# Altium schematic sheet bumblebee.SchDoc: bumblebee macropad
size A3; DrawnBy: Samir Ahmed; DocumentNumber: 1; Revision: 0.2; SheetNumber: 1; SheetTotal: 1; ENG_APP_DATE: --/--/--; DSN_APP_DATE: --/--/--; CHK_APP_DATE: --/--/--
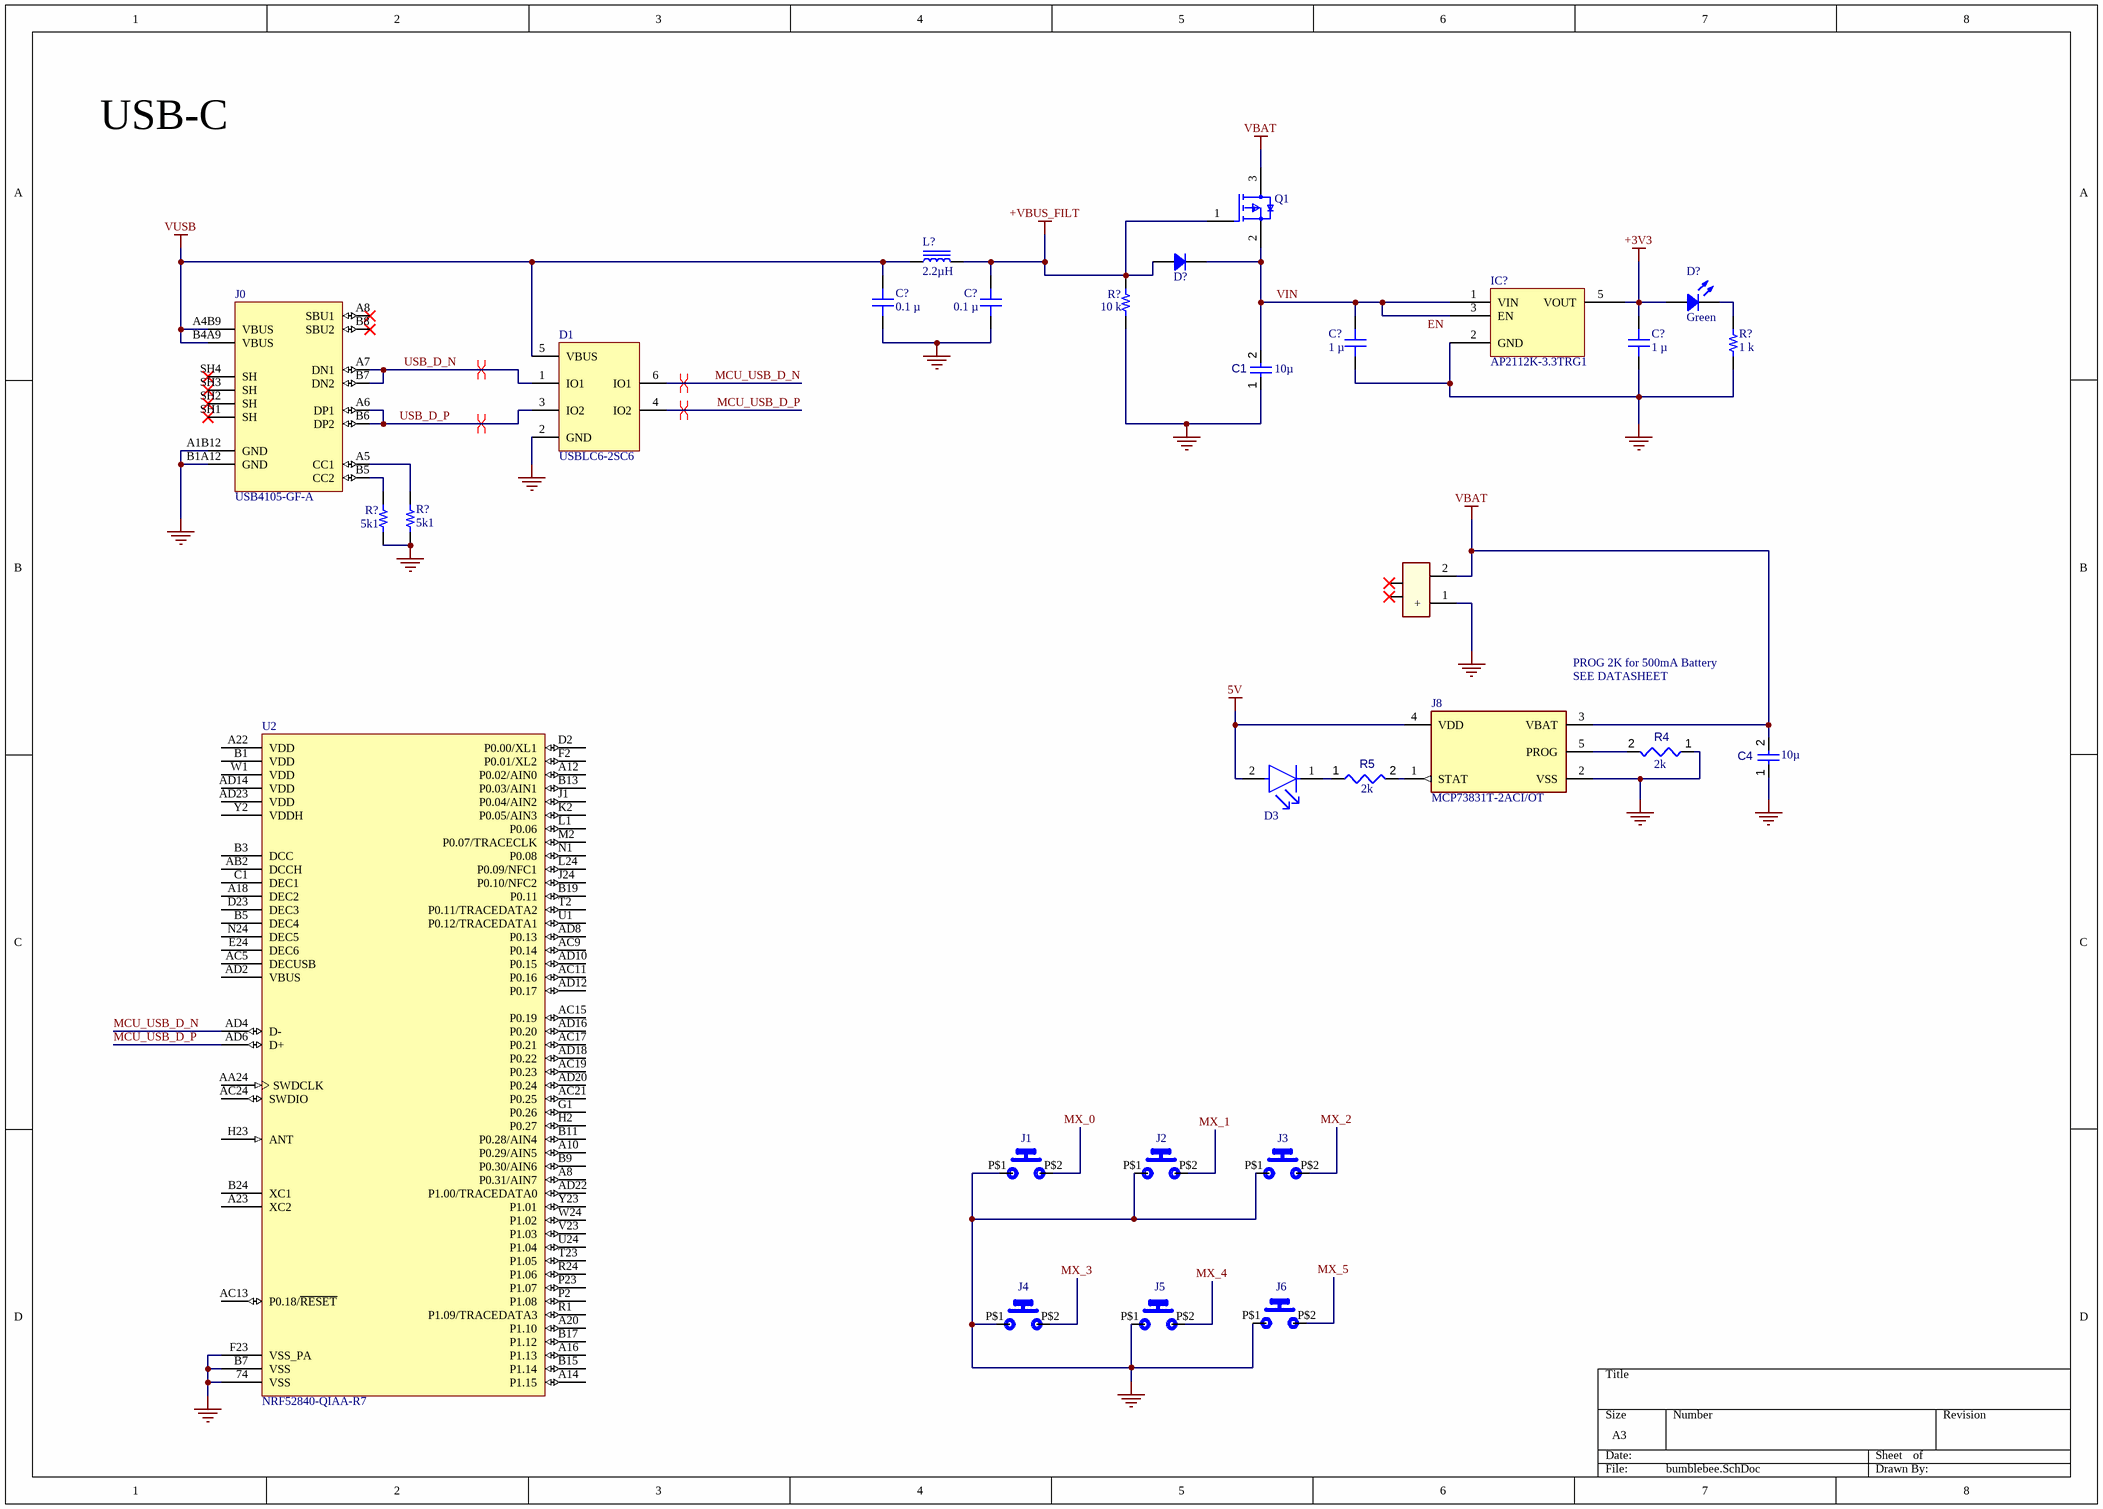
[diagram p0: bumblebee.SchDoc]

## Parts
(Parts that share a designator on the sheet are numbered #1, #2 ... from top to bottom, then left to right.)
C1  value 10µ  [CAPC0603(1608)100_L]  (hidden comment: Capacitor 10µF +/-20% 10V 0603)
C4  value 10µ  [CAPC0603(1608)100_L]  (hidden comment: Capacitor 10µF +/-20% 10V 0603)
C?#1  0.1 µ  [CAP 0402_1005]
C?#2  0.1 µ  [CAP 0402_1005]
C?#3  1 µ  [CAP 0402_1005]
C?#4  1 µ  [CAP 0402_1005]
D1  USBLC6-2SC6  [STM-SOT23-6L_V]
D3  APHCM2012SYCK-F01  [FP-APHCM2012SYCK-F01-MFG]  (value not drawn)
D?#1  US1DWF-7  [SOD123F]  (value not drawn)
D?#2  Green  [LED 0603_1608 GREEN]
IC?  AP2112K-3.3TRG1  [DIODES SOT-23-5 W5]
J0  USB4105-GF-A  [GCT_USB4105-GF-A]
J1  MX1A-11NN  [CHERRY_MX1A-11NN_SWITCH]  (value not drawn)
J2  MX1A-11NN  [CHERRY_MX1A-11NN_SWITCH]  (value not drawn)
J3  MX1A-11NN  [CHERRY_MX1A-11NN_SWITCH]  (value not drawn)
J4  MX1A-11NN  [CHERRY_MX1A-11NN_SWITCH]  (value not drawn)
J5  MX1A-11NN  [CHERRY_MX1A-11NN_SWITCH]  (value not drawn)
J6  MX1A-11NN  [CHERRY_MX1A-11NN_SWITCH]  (value not drawn)
J7  T1M-02-T-SH-L-K  [SAMTEC_T1M-02-T-SH-L-K]  (value not drawn)
J8  MCP73831T-2ACI/OT  [SOT95P280X145-5N]
L?  2.2µH  [IND 0603_1608 RF WW]
Q1  DMG2305UX-13  [FP-SOT23-MFG]  (value not drawn)
R4  value 2k  [RESC1608X55X25ML10T15]  (hidden comment: Resistor 100k +/-1% 0603 100 mW)
R5  value 2k  [RESC1608X55X25ML10T15]  (hidden comment: Resistor 1k +/-1% 0603 100 mW)
R?#1  10 k  [RES 0603_1608]
R?#2  1 k  [RES 0402_1005]
R?#3  5k1  [RES 0402_1005]
R?#4  5k1  [RES 0402_1005]
U2  NRF52840-QIAA-R7  [NRSC-AQFN-73]

## Nets
5V: D3.2(A) J8.4(VDD)
+3V3: C?#4.2 D?#2.1 IC?.5(VOUT)
+VBUS_FILT: C?#2.2 D?#1.1 L?.2 Q1.1(G) R?#1.2
GND: C1.1 C4.1 C?#1.1 C?#2.1 C?#3.1 C?#4.1 D1.2(GND) IC?.2(GND) J0.A1B12(GND) J0.B1A12(GND) J1.P$1(P) J2.P$1(P) J3.P$1(P) J4.P$1(P) J5.P$1(P) J7.1(+) J8.2(VSS) R4.1 R?#1.1 R?#2.2 R?#3.1 R?#4.1 U2.74(VSS) U2.B7(VSS) U2.F23(VSS_PA)
VBAT: C4.2 J7.2 J8.3(VBAT) Q1.3(D)
VUSB: C?#1.2 D1.5(VBUS) J0.A4B9(VBUS) J0.B4A9(VBUS) L?.1
EN: C1.2 C?#3.2 D?#1.2 IC?.1(VIN) IC?.3(EN) Q1.2(S)  [also labelled VIN]
MCU_USB_D_N: D1.6(IO1) U2.AD4(D-)
MCU_USB_D_P: D1.4(IO2) U2.AD6(D+)
MX_0: J1.P$2(S)
MX_1: J2.P$2(S)
MX_2: J3.P$2(S)
MX_3: J4.P$2(S)
MX_4: J5.P$2(S)
MX_5: J6.P$2(S)
USB_D_N: D1.1(IO1) J0.A7(DN1) J0.B7(DN2)
USB_D_P: D1.3(IO2) J0.A6(DP1) J0.B6(DP2)
NetD3_1: D3.1(C) R5.1
NetD?#2_2: D?#2.2 R?#2.1
NetJ0_A5: J0.A5(CC1) R?#4.2
NetJ0_B5: J0.B5(CC2) R?#3.2
NetJ8_1: J8.1(STAT) R5.2
NetJ8_5: J8.5(PROG) R4.2

Not connected (* = marked no-connect by the designer): J0 A8(SBU1)* B8(SBU2)* SH1(SH)* SH2(SH)* SH3(SH)* SH4(SH)*; J6 P$1(P); J7 S1(NC)* S2(NC)*; U2 A8(P0.31/AIN7) A10(P0.29/AIN5) A12(P0.02/AIN0) A14(P1.15) A16(P1.13) A18(DEC2) A20(P1.10) A22(VDD) A23(XC2) AA24(SWDCLK) AB2(DCCH) AC5(DECUSB) AC9(P0.14) AC11(P0.16) AC13(P0.18/~{RESET}) AC15(P0.19) AC17(P0.21) AC19(P0.23) AC21(P0.25) AC24(SWDIO) AD2(VBUS) AD8(P0.13) AD10(P0.15) AD12(P0.17) AD14(VDD) AD16(P0.20) AD18(P0.22) AD20(P0.24) AD22(P1.00/TRACEDATA0) AD23(VDD) B1(VDD) B3(DCC) B5(DEC4) B9(P0.30/AIN6) B11(P0.28/AIN4) B13(P0.03/AIN1) B15(P1.14) B17(P1.12) B19(P0.11) B24(XC1) C1(DEC1) D2(P0.00/XL1) D23(DEC3) E24(DEC6) F2(P0.01/XL2) G1(P0.26) H2(P0.27) H23(ANT) J1(P0.04/AIN2) J24(P0.10/NFC2) K2(P0.05/AIN3) L1(P0.06) L24(P0.09/NFC1) M2(P0.07/TRACECLK) N1(P0.08) N24(DEC5) P2(P1.08) P23(P1.07) R1(P1.09/TRACEDATA3) R24(P1.06) T2(P0.11/TRACEDATA2) T23(P1.05) U1(P0.12/TRACEDATA1) U24(P1.04) V23(P1.03) W1(VDD) W24(P1.02) Y2(VDDH) Y23(P1.01)

## Layout directives
differential pair: MCU_USB_D_N, MCU_USB_D_P, USB_D_N, USB_D_P

## Notes on the sheet
- USB-C
- PROG 2K for 500mA Battery
- (near J8) SEE DATASHEET
- DWG. NO.
- REV.
- SHT.
- THIS DOCUMENT AND THE DATA DISCLOSED HEREIN OR HEREWITH IS THE PROPERTY OF ALTIUM LIMITED AND MAY BE FREELY DISTRIBUTED IN WHOLE. NO RIGHTS ARE RESERVED OR EXPRESS OR IMPLIED WARANTEE GIVEN.
- REVISION
- DESCRIPTION
- DATE
- APPROVED
- ENG:
- APPROVALS
- PROJECT
- DSN:
- CHK:
- REFERENCE DOCUMENTS
- PROJECT REVISION:
- TITLE
- DOCUMENT REVISION:
- DESIGN ITEM:
- BOM:
- FAB DWG:
- PCB DWG:
- ASSY DWG:
- SCALE:
- SIZE
- B
- CAGE CODE
- FILE NAME
- DWG NO.
- SHEET
- OF
- REV

## Library data of the parts
C1 C4 = CMP-001-00075-5: Chip Capacitor, 10µF +/-20%, 10V, 0603, Thickness 1 mm; Tolerance: 10%; Case/Package: 0603; Mounting Technology: SMT; Pins: 2; Max Operating Temperature: 85°C; Voltage Rating: 10V; Min Operating Temperature: -55°C
C?#1 C?#2 = CL05B104KP5VPNC: CAP CER 100NF 10V X7R 0402; manufacturer: Samsung Electro-Mechanics; Capacitance: 0.1 µF; Tolerance: ±10%; Part Number: CL05B104KP5VPNC; Value: 0.1 µ; Applications: Automotive; componentlink1description: Datasheet; componentlink1url: https://mm.digikey.com/Volume0/opasdata/d220001/medias/docus/5458/CL05B104KP5VPNC_Spec.pdf; componentlink2description: DigiKey Link; componentlink2url: https://www.digikey.com/en/products/detail/samsung-electro-mechanics/CL05B104KP5VPNC/20498482; Device Package: 0402 (1005 Metric); lastupdated: 2/9/2024 8:03:17 PM; Lifecycle Status: Active; Minimum Order: 1; Mounting Type: Surface Mount, MLCC; Operating Temperature: -55°C ~ 125°C; Package / Case: 0402 (1005 Metric); packaging: TapeAndReel; partid: 56690; price: 0.01; Ratings: AEC-Q200; series: CL; Size / Dimension: 0.039" L x 0.020" W (1.00mm x 0.50mm); Supplier 1: DigiKey; Supplier Part Number 1: 1276-CL05B104KP5VPNCCT-ND; Temperature Coefficient: X7R; Thickness (Max): 0.022" (0.55mm); Voltage - Rated: 10V
C?#3 C?#4 = 885012105012: CAP CER 1UF 10V X5R 0402; manufacturer: Würth Elektronik; Capacitance: 1 µF; Tolerance: ±20%; Part Number: 885012105012; Value: 1 µ; Applications: General Purpose; componentlink1description: Datasheet; componentlink1url: https://katalog.we-online.de/pbs/datasheet/885012105012.pdf; componentlink2description: DigiKey Link; componentlink2url: https://www.digikey.com/en/products/detail/würth-elektronik/885012105012/5453344; Device Package: 0402 (1005 Metric); lastupdated: 2/9/2024 8:04:38 PM; Lifecycle Status: Active; Minimum Order: 1; Mounting Type: Surface Mount, MLCC; Operating Temperature: -55°C ~ 85°C; Package / Case: 0402 (1005 Metric); packaging: TapeAndReel; partid: 1807; Part Status: Active; price: 0.16; series: WCAP-CSGP; Size / Dimension: 0.039" L x 0.020" W (1.00mm x 0.50mm); Supplier 1: DigiKey; Supplier Part Number 1: 732-7489-1-ND; Temperature Coefficient: X5R; Thickness (Max): 0.022" (0.55mm); Voltage - Rated: 10V
D1 = CMP-004-00037-5: Trans Voltage Suppressor Diode, 5V V(RWM), Unidirectional, 1 Element, Silicon; Max Operating Temperature: 125°C; Mounting Technology: SMD; Min Operating Temperature: -40°C; RoHS Compliant: Yes; Case/Package: SOT-23-6; Pins: 6
D3 = CMP-44529-000064-1: LED YELLOW CLEAR CHIP SMD; Number of LEDs: 1; Luminous Intensity: 150mcd; Dominant Wavelength: 590nm; Test Current: 20mA; Illumination Color: Green; Forward Voltage: 2V; Viewing Angle: 110°; Number of Pins: 2; Packaging: Tape and Reel; Width: 1.25mm; Height: 0.4mm; Lens Color: Clear; RoHS Compliant: Yes; Lead Free: Lead Free; Min Operating Temperature: -40°C; Case Code (Imperial): 0805; Case/Package: 0805; Series: APHCM; Wavelength: 590nm; Max Operating Temperature: 85°C; Length: 2mm; Color: Yellow; Package Quantity: 2000; Mount: Surface Mount; Lens Style: Clear; Forward Current: 20mA; Case Code (Metric): 2012
D?#1 = US1DWF-7: DIODE GEN PURP 200V 1A SOD123F; Manufacturer: Diodes Incorporated; Capacitance @ Vr, F: 14pF @ 4V, 1MHz; Current - Reverse Leakage @ Vr: 5 µA @ 200 V; Diode Type: Standard; Reverse Recovery Time (trr): 35 ns; Speed: Fast Recovery =< 500ns, > 200mA (Io); Voltage - Forward (Vf) (Max) @ If: 950 mV @ 1 A; Part Number: US1DWF-7; ComponentLink1Description: Datasheet; ComponentLink1URL: https://www.diodes.com/assets/Datasheets/US1DWF.pdf; ComponentLink2Description: DigiKey Link; ComponentLink2URL: https://www.digikey.com/en/products/detail/diodes-incorporated/US1DWF-7/7422876; Current - Average Rectified (Io): 1A; LastUpdated: 3/11/2024 7:46:45 AM; Lifecycle Status: Active; Minimum Order: 1; Mounting Type: Surface Mount; Operating Temperature - Junction: -55°C ~ 150°C; Package / Case: SOD-123F; Packaging: TapeAndReel; PartId: 1114; Part Status: Active; Price: 0.10; Series: -; Supplier 1: DigiKey; Supplier Part Number 1: US1DWF-7DICT-ND; Supplier Device Package: SOD-123F; Voltage - DC Reverse (Vr) (Max): 200 V
D?#2 = SM0603GC: LED GREEN CLEAR 0603 SMD; Manufacturer: Bivar Inc.; Configuration: Standard; Current - Test: 20mA; Lens Color: Colorless; Lens Size: 1.00mm x 0.80mm; Lens Style: Rectangle with Flat Top; Millicandela Rating: 15mcd; Viewing Angle: 130°; Voltage - Forward (Vf) (Typ): 2.1V; Wavelength - Dominant: 565nm; Wavelength - Peak: 568nm; Part Number: SM0603GC; Color: Green; ComponentLink1Description: Datasheet; ComponentLink1URL: https://www.bivar.com/Files/Datasheets/SM0603GC.pdf; ComponentLink2Description: DigiKey Link; ComponentLink2URL: https://www.digikey.com/en/products/detail/bivar-inc/SM0603GC/2408543; Device Package: 0603 (1608 Metric); Height (Max): 0.80mm; LastUpdated: 3/11/2024 7:51:11 AM; Lens Transparency: Clear; Lifecycle Status: Active; Minimum Order: 1; Mounting Type: Surface Mount; Package / Case: 0603 (1608 Metric); Packaging: TapeAndReel; PartId: 597; Part Status: Active; Price: 0.28; Series: -; Size / Dimension: 1.60mm L x 0.80mm W; Supplier 1: DigiKey; Supplier Part Number 1: 492-1324-1-ND; Supplier Device Package: 0603; Value: Green
IC? = AP2112K-3.3TRG1: IC REG LINEAR 3.3V 600MA SOT25; Manufacturer: Diodes Incorporated; Control Features: Enable; Current - Quiescent (Iq): 80 µA; Number of Regulators: 1; Output Configuration: Positive; Output Type: Fixed; Protection Features: Over Current, Over Temperature; PSRR: 65sB (100Hz ~ 1KHz); Voltage Dropout (Max): 0.4V @ 600mA; Voltage - Input (Max): 6V; Part Number: AP2112K-3.3TRG1; ComponentLink1Description: Datasheet; ComponentLink1URL: https://www.diodes.com/assets/Datasheets/AP2112.pdf; ComponentLink2Description: DigiKey Link; ComponentLink2URL: https://www.digikey.com/en/products/detail/diodes-incorporated/AP2112K-3-3TRG1/4470746; Current - Output: 600mA; LastUpdated: 2/8/2024 9:47:45 PM; Lifecycle Status: Active; Minimum Order: 1; Mounting Type: Surface Mount; Operating Temperature: -40°C ~ 85°C; Package / Case: SC-74A, SOT-753; Packaging: TapeAndReel; Part Status: Active; Price: 0.08; Series: -; Supplier 1: DigiKey; Supplier Part Number 1: AP2112K-3.3TRG1DICT-ND; Supplier Device Package: SOT-25; Voltage - Output (Min/Fixed): 3.3V
J0 = CMP-002-00080-2: USB-C (USB TYPE-C) USB 2.0 Receptacle Connector 24 (16+8 Dummy) Position Surface Mount, Right Angle; Through Hole; Gender: Female; Pins: 16; Source: USB4105-GF-A.SchLib; MP: USB4105-GF-A; Mounting Technology: SMT; Connector Type: USB-C; Design Item ID: USB4105-GF-A; Case/Package: None; Component Type: Standard
J1-J6 = CMP-003-000001-6: Pushbutton Switch SPST-NO Keyswitch Panel Mount, Front; Component Type: Standard; Case/Package: TH
J7 = CMP-015-000000-2: 1mm JST Connector, surface mounted, horizontal orientation.; Pin Count: 2; MP: T1M-02-T-SH-L-K; Package: None; Source: T1M-02-T-SH-L-K.SchLib; Component Type: Standard; Availability: Unavailable; Design Item ID: T1M-02-T-SH-L-K; Price: None; Value: *
J8 = CMP-017-000000-5: Charger IC Lithium Ion/Polymer SOT-23-5; MF: Microchip; Purchase-URL: https://pricing.snapeda.com/search/part/MCP73831T-2ACI/OT/?ref=eda; Pin Count: 5; Design Item ID: MCP73831T-2ACI/OT; MP: MCP73831T-2ACI/OT; Component Type: Standard; Check_prices: https://www.snapeda.com/parts/MCP73831T-2ACI/OT/Microchip/view-part/?ref=eda; Value: *; Package: SOT-23 Microchip; Availability: In Stock; SnapEDA_Link: https://www.snapeda.com/parts/MCP73831T-2ACI/OT/Microchip/view-part/?ref=snap; Price: None; Source: MCP73831T-2ACI_OT.SchLib
L? = L0603B2R2MDWFT: FIXED IND 2.2UH 560MA 170MOHM; Manufacturer: KEMET; Frequency - Self Resonant: 80MHz; Inductance Frequency - Test: 7.96MHz; Material - Core: Ferrite; Shielding: Unshielded; Tolerance: ±20%; Type: Wirewound; Part Number: L0603B2R2MDWFT; ComponentLink1Description: Datasheet; ComponentLink1URL: https://api.kemet.com/component-edge/download/datasheet/L0603B2R2MDWFT.pdf; ComponentLink2Description: DigiKey Link; ComponentLink2URL: http://digikey.com/product-detail/en/kemet/L0603B2R2MDWFT/399-17783-1-ND/8601446; Current Rating (Amps): 560mA; DC Resistance (DCR): 170mOhm; Device Package: 0603 (1608 Metric); Height - Seated (Max): 0.039" (1.00mm); Inductance: 2.2µH; LastUpdated: 9/6/2020 11:05:21 AM; Lifecycle Status: Active; Minimum Order: 1; Mounting Type: Surface Mount; Operating Temperature: -40°C ~ 105°C; Package / Case: 0603 (1608 Metric); Packaging: TapeAndReel; PartId: 1448; Part Status: Active; Price: 0.15; Series: L-DWF; Size / Dimension: 0.063" L x 0.031" W (1.60mm x 0.80mm); Supplier 1: DigiKey; Supplier Part Number 1: 399-17783-1-ND; Supplier Device Package: 0603 (1608 Metric); Value: 2.2µH
Q1 = CMP-12801-000021-1: MOSFET P-CH 20V 4.2A SOT23; Manufacturer: Diodes Inc.; Input Capacitace At Vds: 808pF @ -15V; Rthja Max: 90°C/W; Drain To Source Voltage: -20V; Standoff Height: 0.013mm; Number Of P Channels: 1; Gate To Source Voltage: 8V; Turn On Delay Time: 10.8ns; Pulse Drain Current: -15A; Threshold Vgs Max: -0.9V; Max Junction Temp: +150°C; Depletion Mode: False; Drain To Source Resistance: 40mΩ; Threshold Vgs Min: -0.5V; Continuous Drain Current: -4.2A; Turn Off Delay Time: 79.3ns; Gate Charge At Vgs: 10.2nC @ -4.5V; Power Dissipation: 1.4W; Digikey Description: MOSFET P-CH 20V 4.2A SOT23; Temperature Range High: +150°C; Height: 1.1mm; Package: SOT23; Footprint Url: https://www.diodes.com/assets/Package-Files/SOT23.pdf; Device Class L3: MOSFETs; RoHS: TRUE; Temperature: -55°C to +150°C; Mouser Description: MOSFET P-Ch ENH FET -20V 52mOhm -5.0V; Temperature Range Low: -55°C; ComponentLink2Description: Datasheet; Manufacturer Part Number: DMG2305UX-13; Octopart: https://octopart.com/dmg2305ux-13-diodes+inc.-29925594; Ipc Land Pattern Name: SOT92P240X102-3; Device Class L2: Transistors; Automotive: No; Number Of Channels: 1; Drain To Source Breakdown Voltage: -20V; Lead Free: Yes; Device Class L1: Discrete Semiconductors; Category: Trans; ComponentLink2URL: https://www.diodes.com/assets/Datasheets/DMG2305UX.pdf
R4 = CMP-009-00023-5: Chip Resistor, 100 KOhm, +/- 1%, 0.1 W, -55 to 155 degC, 0603 (1608 Metric); Voltage Rating: 50V; Power: 100mW; Max Operating Temperature: 155°C; RoHS Compliant: True; Tolerance: 1%; Pins: 2; Case/Package: 0603; Mounting Technology: SM; Min Operating Temperature: -55°C
R5 = CMP-009-00014-5: Chip Resistor, 1 KOhm, +/-1%, 0.1 W, -55 to 155 degC, 0603 (1608 Metric); Voltage Rating: 50V; Power: 100mW; Tolerance: 1%; Mounting Technology: SM; Pins: 2; Case/Package: 0603; Min Operating Temperature: -55°C; RoHS Compliant: True; Max Operating Temperature: 155°C
R?#1 = RNCS0603BKE10K0: RES 10K OHM 0.1% 1/16W 0603; Manufacturer: Stackpole Electronics Inc; Power (Watts): 0.063W, 1/16W; Resistance: 10 kOhms; Temperature Coefficient: ±25ppm/°C; Part Number: RNCS0603BKE10K0; Value: 10 k; ComponentLink1Description: Datasheet; ComponentLink1URL: https://www.seielect.com/catalog/sei-rncs_rnch.pdf; ComponentLink2Description: DigiKey Link; ComponentLink2URL: https://www.digikey.com/en/products/detail/stackpole-electronics-inc/RNCS0603BKE10K0/1708836; Composition: Thin Film; Device Package: 0603 (1608 Metric); Features: Anti-Corrosive, Automotive AEC-Q200, Moisture Resistant; Height - Seated (Max): 0.022" (0.55mm); LastUpdated: 2/9/2024 8:43:37 PM; Lifecycle Status: Active; Minimum Order: 1; Number of Terminations: 2; Operating Temperature: -55°C ~ 155°C; Package / Case: 0603 (1608 Metric); Packaging: TapeAndReel; PartId: 4838; Part Status: Active; Price: 0.06; Ratings: AEC-Q200; Series: RNCS; Size / Dimension: 0.061" L x 0.031" W (1.55mm x 0.80mm); Supplier 1: DigiKey; Supplier Part Number 1: RNCS0603BKE10K0CT-ND; Supplier Device Package: 0603; Tolerance: ±0.1%
R?#2 = RQ73C1E1K0BTD: RES 1 KOHMS 0.1% 1/16W 0402; Manufacturer: TE Connectivity Passive Product; Power (Watts): 0.063W, 1/16W; Resistance: 1 kOhms; Temperature Coefficient: ±10ppm/°C; Part Number: RQ73C1E1K0BTD; Value: 1 k; ComponentLink1Description: Datasheet; ComponentLink1URL: //media.digikey.com/pdf/Data%20Sheets/Tyco%20Electronics%20P%20B%20PDFs/RQ73-0618%20v2.pdf; ComponentLink2Description: DigiKey Link; ComponentLink2URL: https://www.digikey.com/en/products/detail/te-connectivity-passive-product/RQ73C1E1K0BTD/9479889; Composition: Thin Film; Device Package: 0402 (1005 Metric); Features: Anti-Sulfur, Automotive AEC-Q200; Height - Seated (Max): 0.016" (0.40mm); LastUpdated: 2/9/2024 8:30:21 PM; Lifecycle Status: Active; Minimum Order: 1; Number of Terminations: 2; Operating Temperature: -55°C ~ 155°C; Package / Case: 0402 (1005 Metric); Packaging: TapeAndReel; PartId: 3061; Part Status: Active; Price: 0.27; Ratings: AEC-Q200; Series: RQ73; Size / Dimension: 0.039" L x 0.020" W (1.00mm x 0.50mm); Supplier 1: DigiKey; Supplier Part Number 1: A139941CT-ND; Supplier Device Package: 0402; Tolerance: ±0.1%
R?#3 R?#4 = RT0402BRE075K1L: RES SMD 5.1K OHM 0.1% 1/16W 0402; Manufacturer: Yageo; Power (Watts): 0.063W, 1/16W; Resistance: 5.1 kOhms; Temperature Coefficient: ±50ppm/°C; Part Number: RT0402BRE075K1L; Value: 5k1; ComponentLink1Description: Datasheet; ComponentLink1URL: https://www.yageo.com/upload/media/product/productsearch/datasheet/rchip/PYu-RT_1-to-0.01_RoHS_L_11.pdf; ComponentLink2Description: DigiKey Link; ComponentLink2URL: https://www.digikey.com/en/products/detail/yageo/RT0402BRE075K1L/1069792; Composition: Thin Film; Device Package: 0402 (1005 Metric); Height - Seated (Max): 0.014" (0.35mm); LastUpdated: 2/9/2024 8:30:15 PM; Lifecycle Status: Active; Minimum Order: 1; Number of Terminations: 2; Operating Temperature: -55°C ~ 155°C; Package / Case: 0402 (1005 Metric); Packaging: TapeAndReel; PartId: 4590; Part Status: Active; Price: 0.04; Series: RT; Size / Dimension: 0.039" L x 0.020" W (1.00mm x 0.50mm); Supplier 1: DigiKey; Supplier Part Number 1: YAG4404CT-ND; Supplier Device Package: 0402; Tolerance: ±0.1%
U2 = CMP-020-00027-1: IC RF TxRx + MCU 802.15.4, Bluetooth Bluetooth v5.0, Thread, Zigbee® 2.4GHz 73-VFQFN Dual Rows, Exposed Pad; RAM Size: 256kB RAM; Max Supply Voltage: 5.5V; I/Os: 48; Nominal Supply Voltage: 3.3V; Interface: ADC, I2S, PDM, PWM, SPI, TWI, UART, USB; Min Supply Voltage: 1.7V; Frequency: 2.4GHz; Pins: 73; Mfr. Part #: NRF52840-QIAA-R7; Case/Package: 73-VFQFN Dual Rows, Exposed Pad; RoHS Compliant: ROHS3 Compliant; Mounting Technology: Surface Mount